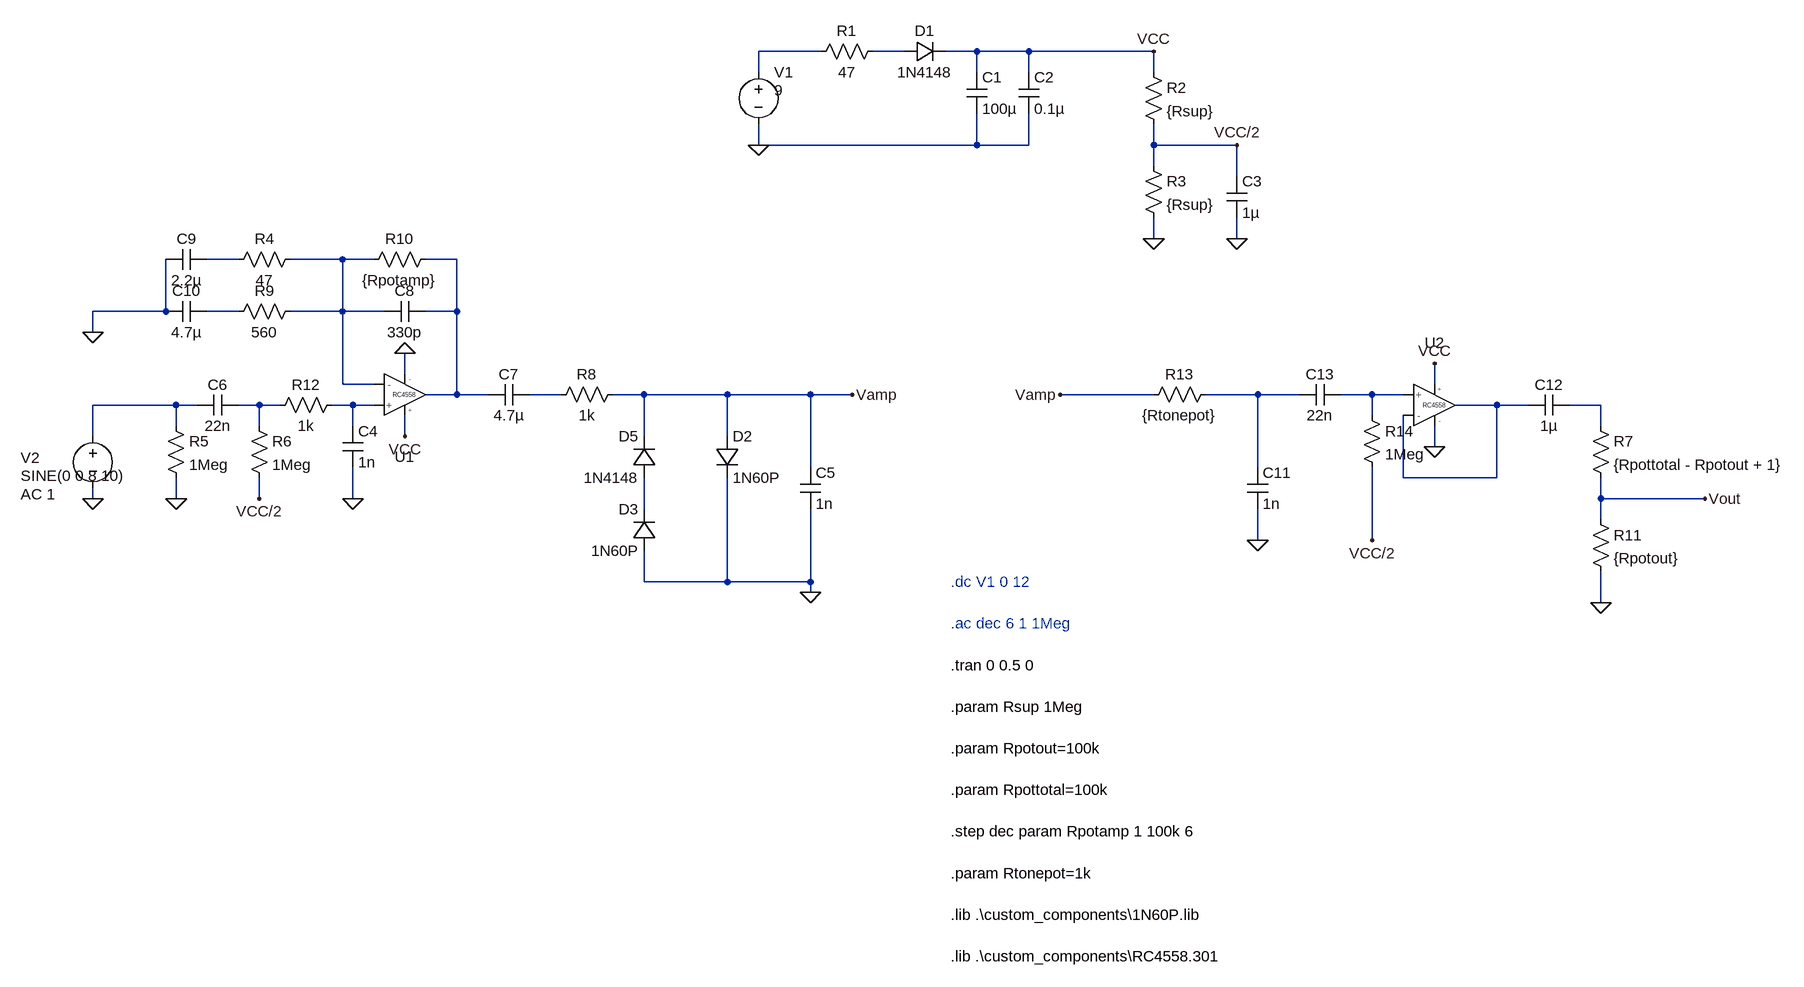
[diagram p0: schematic Distortion.asc]
Distortion.asc, the LTspice schematic file:
Version 4.1
SHEET 1 2068 2816
WIRE 544 848 448 848
WIRE 672 848 624 848
WIRE 784 848 736 848
WIRE 864 848 784 848
WIRE 1056 848 864 848
WIRE 448 880 448 848
WIRE 784 880 784 848
WIRE 864 880 864 848
WIRE 1056 880 1056 848
WIRE 448 992 448 960
WIRE 784 992 784 944
WIRE 784 992 448 992
WIRE 864 992 864 944
WIRE 864 992 784 992
WIRE 1056 992 1056 960
WIRE 1184 992 1056 992
WIRE 1056 1024 1056 992
WIRE 1184 1040 1184 992
WIRE 1056 1136 1056 1104
WIRE 1184 1136 1184 1104
WIRE -352 1168 -400 1168
WIRE -192 1168 -272 1168
WIRE -144 1168 -192 1168
WIRE -16 1168 -64 1168
WIRE -464 1248 -464 1168
WIRE -464 1248 -576 1248
WIRE -352 1248 -400 1248
WIRE -192 1248 -192 1168
WIRE -192 1248 -272 1248
WIRE -128 1248 -192 1248
WIRE -16 1248 -16 1168
WIRE -16 1248 -64 1248
WIRE -576 1280 -576 1248
WIRE -96 1344 -96 1312
WIRE -192 1360 -192 1248
WIRE -144 1360 -192 1360
WIRE 1488 1360 1488 1328
WIRE -16 1376 -16 1248
WIRE -16 1376 -64 1376
WIRE 32 1376 -16 1376
WIRE 144 1376 96 1376
WIRE 272 1376 224 1376
WIRE 400 1376 272 1376
WIRE 528 1376 400 1376
WIRE 592 1376 528 1376
WIRE 1056 1376 912 1376
WIRE 1216 1376 1136 1376
WIRE 1280 1376 1216 1376
WIRE 1392 1376 1344 1376
WIRE 1440 1376 1392 1376
WIRE -448 1392 -576 1392
WIRE -416 1392 -448 1392
WIRE -320 1392 -352 1392
WIRE -288 1392 -320 1392
WIRE -176 1392 -208 1392
WIRE -144 1392 -176 1392
WIRE 1584 1392 1520 1392
WIRE 1632 1392 1584 1392
WIRE 1744 1392 1696 1392
WIRE 1392 1408 1392 1376
WIRE -448 1424 -448 1392
WIRE -320 1424 -320 1392
WIRE -176 1424 -176 1392
WIRE 1744 1424 1744 1392
WIRE -576 1440 -576 1392
WIRE -96 1440 -96 1408
WIRE 272 1440 272 1376
WIRE 400 1440 400 1376
WIRE 1488 1456 1488 1424
WIRE 528 1488 528 1376
WIRE 1216 1488 1216 1376
WIRE 1440 1504 1440 1408
WIRE 1584 1504 1584 1392
WIRE 1584 1504 1440 1504
WIRE -576 1536 -576 1520
WIRE -448 1536 -448 1504
WIRE -320 1536 -320 1504
WIRE -176 1536 -176 1488
WIRE 1744 1536 1744 1504
WIRE 1904 1536 1744 1536
WIRE 272 1552 272 1504
WIRE 1744 1568 1744 1536
WIRE 1216 1600 1216 1552
WIRE 1392 1600 1392 1488
WIRE 272 1664 272 1616
WIRE 400 1664 400 1504
WIRE 400 1664 272 1664
WIRE 528 1664 528 1552
WIRE 528 1664 400 1664
WIRE 528 1680 528 1664
WIRE 1744 1696 1744 1648
FLAG 448 992 0
FLAG 1056 848 VCC
FLAG 1056 1136 0
FLAG 1184 992 VCC/2
FLAG 1184 1136 0
FLAG -96 1440 VCC
FLAG -96 1312 0
FLAG -576 1536 0
FLAG 592 1376 Vamp
FLAG 528 1680 0
FLAG 1744 1696 0
FLAG 1904 1536 Vout
FLAG -576 1280 0
FLAG -448 1536 0
FLAG -176 1536 0
FLAG -320 1536 VCC/2
FLAG 912 1376 Vamp
FLAG 1488 1456 0
FLAG 1488 1328 VCC
FLAG 1216 1600 0
FLAG 1392 1600 VCC/2
SYMBOL res 640 832 R90
WINDOW 0 0 56 VBottom 2
WINDOW 3 32 56 VTop 2
SYMATTR InstName R1
SYMATTR Value 47
SYMBOL diode 672 864 R270
WINDOW 0 32 32 VTop 2
WINDOW 3 0 32 VBottom 2
SYMATTR InstName D1
SYMATTR Value 1N4148
SYMBOL cap 848 880 R0
SYMATTR InstName C2
SYMATTR Value 0.1µ
SYMBOL voltage 448 864 R0
WINDOW 3 24 44 Left 2
WINDOW 123 24 124 Left 2
WINDOW 39 0 0 Left 0
SYMATTR Value 9
SYMATTR InstName V1
SYMBOL cap 768 880 R0
SYMATTR InstName C1
SYMATTR Value 100µ
SYMBOL res 1040 864 R0
SYMATTR InstName R2
SYMATTR Value {Rsup}
SYMBOL res 1040 1008 R0
SYMATTR InstName R3
SYMATTR Value {Rsup}
SYMBOL cap 1168 1040 R0
SYMATTR InstName C3
SYMATTR Value 1µ
SYMBOL voltage -576 1424 R0
WINDOW 0 -111 49 Left 2
WINDOW 3 -111 77 Left 2
WINDOW 123 -111 105 Left 2
WINDOW 39 0 0 Left 0
SYMATTR InstName V2
SYMATTR Value SINE(0 0.8 10)
SYMATTR Value2 AC 1
SYMBOL cap 96 1360 R90
WINDOW 0 0 32 VBottom 2
WINDOW 3 32 32 VTop 2
SYMATTR InstName C7
SYMATTR Value 4.7µ
SYMBOL res 240 1360 R90
WINDOW 0 0 56 VBottom 2
WINDOW 3 32 56 VTop 2
SYMATTR InstName R8
SYMATTR Value 1k
SYMBOL res 1728 1552 R0
SYMATTR InstName R11
SYMATTR Value {Rpotout}
SYMBOL cap 512 1488 R0
SYMATTR InstName C5
SYMATTR Value 1n
SYMBOL res 1728 1408 R0
SYMATTR InstName R7
SYMATTR Value {Rpottotal - Rpotout + 1}
SYMBOL res -48 1152 R90
WINDOW 0 0 56 VBottom 2
WINDOW 3 32 56 VTop 2
SYMATTR InstName R10
SYMATTR Value {Rpotamp}
SYMBOL cap -64 1232 R90
WINDOW 0 0 32 VBottom 2
WINDOW 3 32 32 VTop 2
SYMATTR InstName C8
SYMATTR Value 330p
SYMBOL res -256 1152 R90
WINDOW 0 0 56 VBottom 2
WINDOW 3 32 56 VTop 2
SYMATTR InstName R4
SYMATTR Value 47
SYMBOL res -256 1232 R90
WINDOW 0 0 56 VBottom 2
WINDOW 3 32 56 VTop 2
SYMATTR InstName R9
SYMATTR Value 560
SYMBOL cap -400 1152 R90
WINDOW 0 0 32 VBottom 2
WINDOW 3 32 32 VTop 2
SYMATTR InstName C9
SYMATTR Value 2.2µ
SYMBOL cap -400 1232 R90
WINDOW 0 0 32 VBottom 2
WINDOW 3 32 32 VTop 2
SYMATTR InstName C10
SYMATTR Value 4.7µ
SYMBOL res -464 1408 R0
SYMATTR InstName R5
SYMATTR Value 1Meg
SYMBOL res -336 1408 R0
SYMATTR InstName R6
SYMATTR Value 1Meg
SYMBOL cap -192 1424 R0
SYMATTR InstName C4
SYMATTR Value 1n
SYMBOL res -192 1376 R90
WINDOW 0 0 56 VBottom 2
WINDOW 3 32 56 VTop 2
SYMATTR InstName R12
SYMATTR Value 1k
SYMBOL cap -352 1376 R90
WINDOW 0 0 32 VBottom 2
WINDOW 3 32 32 VTop 2
SYMATTR InstName C6
SYMATTR Value 22n
SYMBOL res 1152 1360 R90
WINDOW 0 0 56 VBottom 2
WINDOW 3 32 56 VTop 2
SYMATTR InstName R13
SYMATTR Value {Rtonepot}
SYMBOL cap 1200 1488 R0
SYMATTR InstName C11
SYMATTR Value 1n
SYMBOL cap 1696 1376 R90
WINDOW 0 0 32 VBottom 2
WINDOW 3 32 32 VTop 2
SYMATTR InstName C12
SYMATTR Value 1µ
SYMBOL cap 1344 1360 R90
WINDOW 0 0 32 VBottom 2
WINDOW 3 32 32 VTop 2
SYMATTR InstName C13
SYMATTR Value 22n
SYMBOL res 1376 1392 R0
SYMATTR InstName R14
SYMATTR Value 1Meg
SYMBOL custom_components\\1N60P 288 1616 R180
WINDOW 0 24 64 Left 2
WINDOW 3 24 0 Left 2
SYMATTR InstName D3
SYMBOL custom_components\\RC4558 -96 1376 M180
SYMATTR InstName U1
SYMBOL custom_components\\RC4558 1488 1392 R0
SYMATTR InstName U2
SYMBOL custom_components\\1N60P 288 1504 R180
WINDOW 0 24 64 Left 2
WINDOW 3 24 0 Left 2
SYMATTR InstName D5
SYMATTR Value 1N4148
SYMBOL custom_components\\1N60P 384 1440 R0
SYMATTR InstName D2
TEXT 744 1792 Left 2 !.tran 0 0.5 0
TEXT 744 1856 Left 2 !.param Rsup 1Meg
TEXT 744 1920 Left 2 !.param Rpotout=100k
TEXT 744 1984 Left 2 !.param Rpottotal=100k
TEXT 744 2048 Left 2 !.step dec param Rpotamp 1 100k 6
TEXT 744 1728 Left 2 ;.ac dec 6 1 1Meg
TEXT 744 1664 Left 2 ;.dc V1 0 12
TEXT 744 2112 Left 2 !.param Rtonepot=1k
TEXT 744 2176 Left 2 !.lib .\\custom_components\\1N60P.lib
TEXT 744 2240 Left 2 !.lib .\\custom_components\\RC4558.301

The netlist it stands for:
* Distortion.asc
R1 N002 N001 47
D1 N002 VCC 1N4148
C2 VCC 0 0.1µ
V1 N001 0 9
C1 VCC 0 100µ
R2 VCC VCC/2 {Rsup}
R3 VCC/2 0 {Rsup}
C3 VCC/2 0 1µ
V2 N010 0 SINE(0 0.8 10) AC 1
C7 N007 N005 4.7µ
R8 Vamp N007 1k
R11 Vout 0 {Rpotout}
C5 Vamp 0 1n
R7 N014 Vout {Rpottotal - Rpotout + 1}
R10 N005 N004 {Rpotamp}
C8 N005 N004 330p
R4 N004 N003 47
R9 N004 N006 560
C9 N003 0 2.2µ
C10 N006 0 4.7µ
R5 N010 0 1Meg
R6 N011 VCC/2 1Meg
C4 N012 0 1n
R12 N012 N011 1k
C6 N011 N010 22n
R13 N008 Vamp {Rtonepot}
C11 N008 0 1n
C12 N014 N013 1µ
C13 N009 N008 22n
R14 N009 VCC/2 1Meg
D3 0 N015 1N60P
X§U1 N012 N004 VCC 0 N005 RC4558  ; pins 1 2 3 4 5
X§U2 N009 N013 VCC 0 N013 RC4558  ; pins 1 2 3 4 5
D5 N015 Vamp 1N4148
D2 Vamp 0 1N60P
.model D D
.lib standard.dio
.tran 0 0.5 0
.param Rsup 1Meg
.param Rpotout=100k
.param Rpottotal=100k
.step dec param Rpotamp 1 100k 6
* .ac dec 6 1 1Meg
* .dc V1 0 12
.param Rtonepot=1k
.lib .\custom_components\1N60P.lib
.lib .\custom_components\RC4558.301
.lib 1N60P.lib
.backanno
.end